# Altium project MB1829.PrjPcb (part 5 of 5)

## Sheet eMMC.SchDoc: eMMC
size A4; Date: Not used; ApprovedBy: Not used; CheckedBy: Not used; Author: Not used; CompanyName: STMicroelectronics; DrawnBy: Not used; Engineer: Not used; Organization: Not used; Address1: Not used; Address2: Not used; Address3: Not used; Address4: Not used; DocumentNumber: Not used; Revision: Not used; SheetNumber: 8; SheetTotal: 16; CurrentTime: Not used; CurrentDate: Not used; Time: Not used; DocumentFullPathAndName: Not used; DocumentName: Not used; ModifiedDate: Not used; ImagePath: Not used; ProjectName: Not used; Application_BuildNumber: Not used
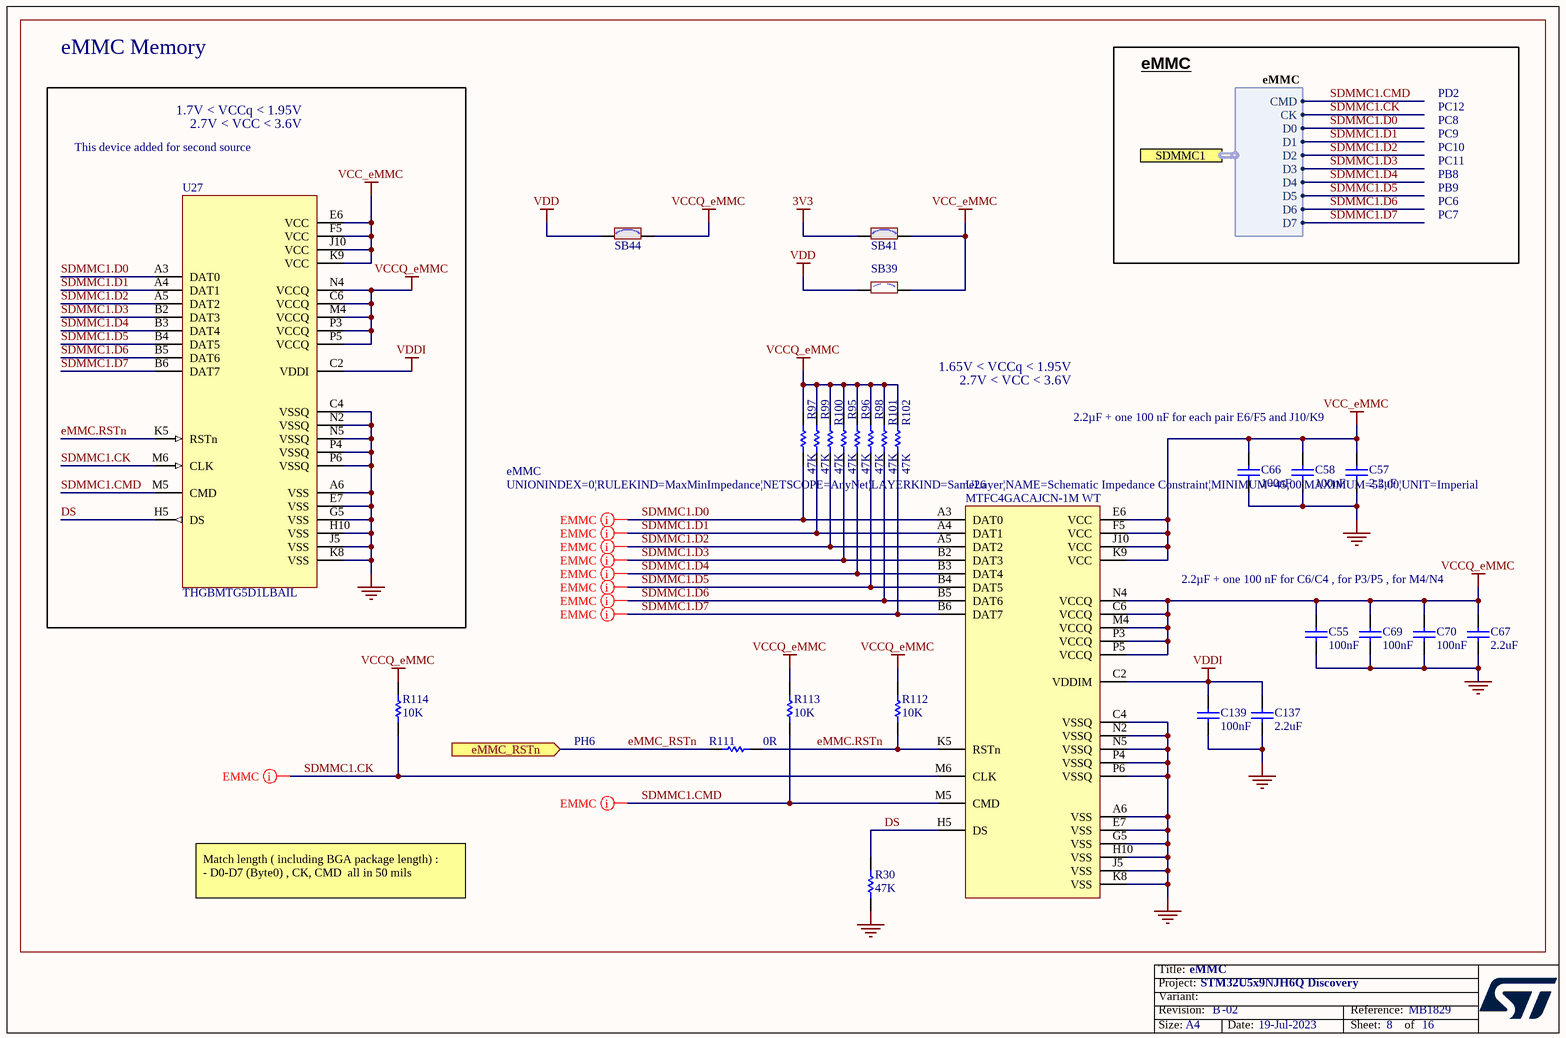
[diagram p12: eMMC.SchDoc]

### Parts
C55  value 100nF  [C0402]  (hidden comment: Capacitor)
C57  value 2.2uF  [C0603]  (hidden comment: Capacitor)
C58  value 100nF  [C0402]  (hidden comment: Capacitor)
C66  value 100nF  [C0402]  (hidden comment: Capacitor)
C67  value 2.2uF  [C0603]  (hidden comment: Capacitor)
C69  value 100nF  [C0402]  (hidden comment: Capacitor)
C70  value 100nF  [C0402]  (hidden comment: Capacitor)
C137  value 2.2uF  [C0603]  (hidden comment: Capacitor)
C139  value 100nF  [C0402]  (hidden comment: Capacitor)
R30  value 47K  [R0402]  (hidden comment: Resistor)
R95  value 47K  [R0402]  (hidden comment: Resistor)
R96  value 47K  [R0402]  (hidden comment: Resistor)
R97  value 47K  [R0402]  (hidden comment: Resistor)
R98  value 47K  [R0402]  (hidden comment: Resistor)
R99  value 47K  [R0402]  (hidden comment: Resistor)
R100  value 47K  [R0402]  (hidden comment: Resistor)
R101  value 47K  [R0402]  (hidden comment: Resistor)
R102  value 47K  [R0402]  (hidden comment: Resistor)
R111  value 0R  [R0402]  (hidden comment: Resistor)
R112  value 10K  [R0402]  (hidden comment: Resistor)
R113  value 10K  [R0402]  (hidden comment: Resistor)
R114  value 10K  [R0402]  (hidden comment: Resistor)
SB39  SB_OFF  [SOLDER-BRIDGE_R0402-0R]  (value not drawn)
SB41  SB_ON  [SOLDER-BRIDGE_R0402-0R]  (value not drawn)
SB44  SB_ON  [SOLDER-BRIDGE_R0402-0R]  (value not drawn)
U26  MTFC4GACAJCN-1M WT  [ICC_P-WFBGA153_13X11P5_P050]
U27  value THGBMTG5D1LBAIL  [ICC_P-WFBGA153_13X11P5_P050]  (hidden comment: eMMC_THGBMTG5D1LBAIL)

### Ports
eMMC_RSTn (in), SDMMC1 (harness eMMC)

### Harnesses
eMMC: D0, CMD, CK, D1, D2, D3, D4, D5, D6, D7

### Nets
3V3: SB41.1
GND: C55.1 C57.1 C58.1 C66.1 C67.1 C69.1 C70.1 C137.1 C139.1 R30.1 U26.A6(VSS) U26.C4(VSSQ) U26.E7(VSS) U26.G5(VSS) U26.H10(VSS) U26.J5(VSS) U26.K8(VSS) U26.N2(VSSQ) U26.N5(VSSQ) U26.P4(VSSQ) U26.P6(VSSQ) U27.A6(VSS) U27.C4(VSSQ) U27.E7(VSS) U27.G5(VSS) U27.H10(VSS) U27.J5(VSS) U27.K8(VSS) U27.N2(VSSQ) U27.N5(VSSQ) U27.P4(VSSQ) U27.P6(VSSQ)
VCC_eMMC: C57.2 C58.2 C66.2 SB39.2 SB41.2 U26.E6(VCC) U26.F5(VCC) U26.J10(VCC) U26.K9(VCC) U27.E6(VCC) U27.F5(VCC) U27.J10(VCC) U27.K9(VCC)
VCCQ_eMMC: C55.2 C67.2 C69.2 C70.2 R95.2 R96.2 R97.2 R98.2 R99.2 R100.2 R101.2 R102.2 R112.2 R113.2 R114.2 SB44.2 U26.C6(VCCQ) U26.M4(VCCQ) U26.N4(VCCQ) U26.P3(VCCQ) U26.P5(VCCQ) U27.C6(VCCQ) U27.M4(VCCQ) U27.N4(VCCQ) U27.P3(VCCQ) U27.P5(VCCQ)
VDD: SB39.1 SB44.1
VDDI: C137.2 C139.2 U26.C2(VDDIM) U27.C2(VDDI)
DS: R30.2 U26.H5(DS) U27.H5(DS)
eMMC.RSTn: R111.2 R112.1 U26.K5(RSTn) U27.K5(RSTn)
eMMC_RSTn: R111.1 ; port eMMC_RSTn
SDMMC1.CK: R114.1 U26.M6(CLK) U27.M6(CLK) ; port SDMMC1.CK
SDMMC1.CMD: R113.1 U26.M5(CMD) U27.M5(CMD) ; port SDMMC1.CMD
SDMMC1.D0: R97.1 U26.A3(DAT0) U27.A3(DAT0) ; port SDMMC1.D0
SDMMC1.D1: R99.1 U26.A4(DAT1) U27.A4(DAT1) ; port SDMMC1.D1
SDMMC1.D2: R100.1 U26.A5(DAT2) U27.A5(DAT2) ; port SDMMC1.D2
SDMMC1.D3: R95.1 U26.B2(DAT3) U27.B2(DAT3) ; port SDMMC1.D3
SDMMC1.D4: R96.1 U26.B3(DAT4) U27.B3(DAT4) ; port SDMMC1.D4
SDMMC1.D5: R98.1 U26.B4(DAT5) U27.B4(DAT5) ; port SDMMC1.D5
SDMMC1.D6: R101.1 U26.B5(DAT6) U27.B5(DAT6) ; port SDMMC1.D6
SDMMC1.D7: R102.1 U26.B6(DAT7) U27.B6(DAT7) ; port SDMMC1.D7

### Layout directives
rule Matched Net Lengths [Tolerance = 20mil]; rule Impedance Constraint [Min = 45.00    Max = 55.00    ]; net class eMMC: SDMMC1.D0
rule Matched Net Lengths [Tolerance = 20mil]; rule Impedance Constraint [Min = 45.00    Max = 55.00    ]: SDMMC1.CK, SDMMC1.D1, SDMMC1.D2, SDMMC1.D3, SDMMC1.D4, SDMMC1.D5, SDMMC1.D6, SDMMC1.D7
rule Matched Net Lengths [Tolerance = 50mil]; rule Impedance Constraint [Min = 45.00    Max = 55.00    ]: SDMMC1.CMD

### Notes on the sheet
- eMMC Memory
- 1.7V < VCCq < 1.95V
- 2.7V < VCC < 3.6V
- eMMC
- PC12
- PD2
- This device added for second source
- PC8
- PC9
- PC10
- PC11
- PB8
- PC6
- PC7
- PB9
- 1.65V < VCCq < 1.95V
- 2.2µF + one 100 nF for each pair E6/F5 and J10/K9
- 2.2µF + one 100 nF for C6/C4 , for P3/P5 , for M4/N4
- PH6
- Match length ( including BGA package length) :
  - D0-D7 (Byte0) , CK, CMD  all in 50 mils
- Title:
- Project:
- Size:
- Revision:
- Variant:
- A4
- -
- Date:
- Reference:
- Sheet:
- of

### Library data of the parts
C55 C58 C66 C69 C70 C139 = MCD-00006: Capacitor, MLCC, 100nF, 16V, X7R, +/-10%, 0402, T=0.5mm; Manufacturer_Part_Number: CC0402KRX7R7BB104; Manufacturer: YAGEO; Part_Preference: Recommended; Order_Code_RS: 616-9701; Component_Country_Of_Origin: China; Internal_Part_Number: MCD-00006; Status: Released; Part_Type: Capacitor; Package: 0402; ComponentLink1URL: http://tunmcdsvn.tun.st.com/Component_Documentation_Library/Trunk/Capacitor/YAGEO_X7R_Series; Order_Code_Digikey: 311-1338-1-ND; Order_Code_Farnell: 9402047
C57 C67 C137 = MCD-00012: Capacitor, MLCC, 2.2uF, 10V, X5R, +/- 10%, 0603, T=0.8mm; Manufacturer_Part_Number: CC0603KRX5R6BB225; Manufacturer: YAGEO; BMS_Part_Number: 9142010; Part_Preference: Recommended; Component_Country_Of_Origin: China; Internal_Part_Number: MCD-00012; Status: Released; Part_Type: Capacitor; Package: 0603; ComponentLink1URL: http://tunmcdsvn.tun.st.com/Component_Documentation_Library/Trunk/Capacitor/YAGEO_X5R_Series; Order_Code_Digikey: 311-1451-1-ND; Order_Code_Farnell: 2370679; Order_Code_RS: N/A
R30 R95-R102 = MCD-00063: Resistor, 47K, 0402, +/-1%, 1/16W; Manufacturer_Part_Number: RC0402FR-0747KL; Manufacturer: YAGEO; Part_Preference: Recommended; Component_Country_Of_Origin: China; Internal_Part_Number: MCD-00063; Status: Released; Part_Type: Resistor; Package: 0402; ComponentLink1URL: http://tunmcdsvn.tun.st.com/Component_Documentation_Library/Trunk/Resistor/YAGEO_RC_L_Series; Order_Code_Digikey: 311-47.0KLRCT-ND; Order_Code_Farnell: 9239430; Order_Code_RS: N/A
R111 = MCD-00052: Resistor, 0R, 0402, +/-5%, 1/16W; Manufacturer_Part_Number: RC0402JR-070RL; Manufacturer: YAGEO; Part_Preference: Recommended; Order_Code_RS: 618-5804; Component_Country_Of_Origin: China; Internal_Part_Number: MCD-00052; Status: Released; Part_Type: Resistor; Package: 0402; ComponentLink1URL: http://tunmcdsvn.tun.st.com/Component_Documentation_Library/Trunk/Resistor/YAGEO_RC_L_Series; Order_Code_Digikey: 311-0.0JRCT-ND; Order_Code_Farnell: 9232516RL
R112-R114 = MCD-00053: Resistor, 10K, 0402, +/-1%, 1/16W; Manufacturer_Part_Number: RC0402FR-0710KL; Manufacturer: YAGEO; BMS_Part_Number: 9131590; Part_Preference: Recommended; Component_Country_Of_Origin: China; Internal_Part_Number: MCD-00053; Status: Released; Part_Type: Resistor; Package: 0402; ComponentLink1URL: http://tunmcdsvn.tun.st.com/Component_Documentation_Library/Trunk/Resistor/YAGEO_RC_L_Series; Order_Code_Digikey: 311-10.0KLRCT-ND; Order_Code_Farnell: 9239359; Order_Code_RS: N/A
SB39 = MCD-02162: Solder Bridge 0402 OFF; Part_Type: Misc; Manufacturer_Part_Number: RC0402JR-070RL; Manufacturer: YAGEO; Part_Preference: Recommended; Order_Code_RS: 618-5804; Component_Country_Of_Origin: China; Internal_Part_Number: MCD-02162; Status: Checked; Package: SB0402; ComponentLink1URL: http://tunmcdsvn.tun.st.com/Component_Datasheet_Library/Trunk/Resistors/Yageo_Resistor_RC0402-series; Order_Code_Digikey: 311-0.0JRTR-ND; Order_Code_Farnell: 2363467
SB41 SB44 = MCD-01618: Solder Bridge 0402 ON; Part_Type: Misc; Manufacturer_Part_Number: RC0402JR-070RL; Manufacturer: YAGEO; Part_Preference: Recommended; Order_Code_RS: 618-5804; Component_Country_Of_Origin: China; Internal_Part_Number: MCD-01618; Status: Released; Package: SB0402; ComponentLink1URL: http://tunmcdsvn.tun.st.com/Component_Datasheet_Library/Trunk/Resistors/Yageo_Resistor_RC0402-series; Order_Code_Digikey: 311-0.0JRTR-ND; Order_Code_Farnell: 2363467
U26 = MCD-01137: 4G MultiMediaCard (MMC) controller and NAND Flash; Part_Type: IC; Manufacturer: MICRON; BMS_Part_Number: 9171977; Part_Preference: Recommended; Component_Country_Of_Origin: Singapore; Internal_Part_Number: MCD-01137; Value: MTFC4GACAJCN-1M WT; Status: Released; Manufacturer_Part_Number: MTFC4GACAJCN-1M WT; Package: FBGA153; ComponentLink1URL: http://tunmcdsvn.tun.st.com/Component_Datasheet_Library/Trunk/IC/MICRON_eMMC_MTFC4GACAJCN-1M WT
U27 = MCD-02799: Memory, eMMC, 4GB, 15nm ,WFBGA , 153 pins; Part_Type: IC; Part_Preference: Recommended; Manufacturer: KIOXIA; Component_Country_Of_Origin: Unknown; ShowFields: YES; ID: 4911; Internal_Part_Number: MCD-02799; Status: Checked; Manufacturer_Part_Number: THGBMTG5D1LBAIL; Package: WFBGA153; ComponentLink1URL: http://tunmcdsvn.tun.st.com/Component_Documentation_Library/Trunk/IC/KIOXIA_THGBMTG5D1LBAIL; Order_Code_Digikey: N/A; Order_Code_Farnell: N/A; Order_Code_RS: N/A

## Sheet HEXADECASPI_PSRAM.SchDoc: HEXADECASPI PSRAM
size A4; Date: Not used; ApprovedBy: Not used; CheckedBy: Not used; Author: Not used; CompanyName: STMicroelectronics; DrawnBy: Not used; Engineer: Not used; Organization: Not used; Address1: Not used; Address2: Not used; Address3: Not used; Address4: Not used; DocumentNumber: Not used; Revision: Not used; SheetNumber: 7; SheetTotal: 16; CurrentTime: Not used; CurrentDate: Not used; Time: Not used; DocumentFullPathAndName: Not used; DocumentName: Not used; ModifiedDate: Not used; ImagePath: Not used; ProjectName: Not used; Application_BuildNumber: Not used
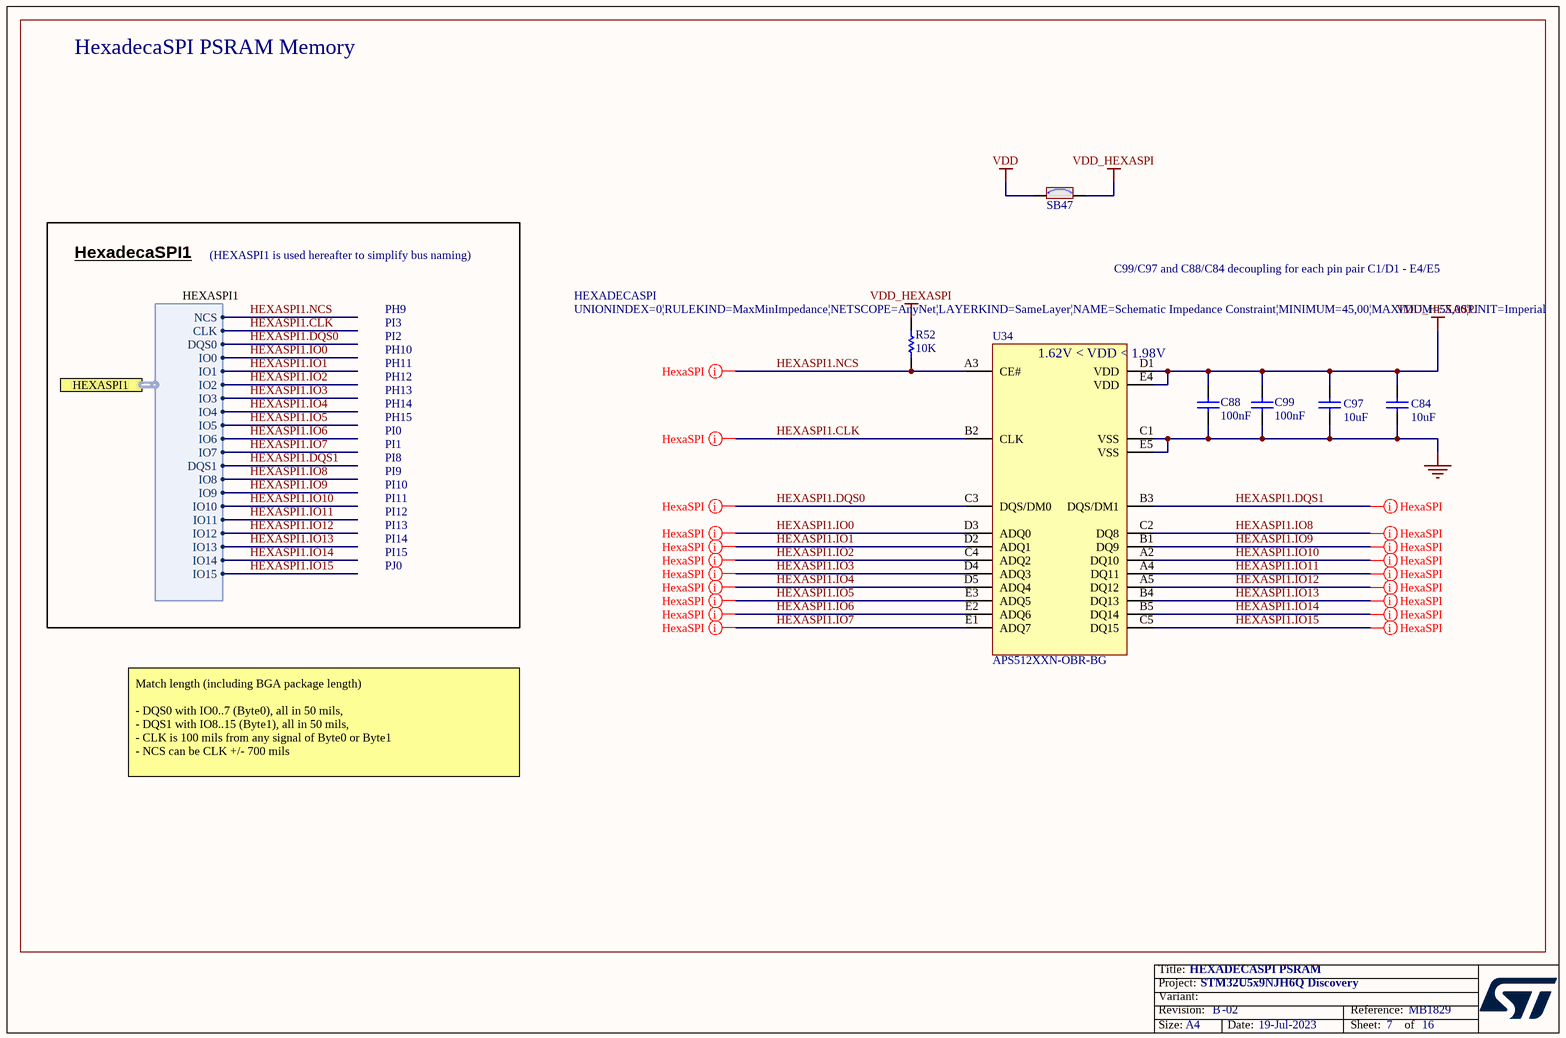
[diagram p13: HEXADECASPI_PSRAM.SchDoc]

### Parts
C84  value 10uF  [C0603_H0P8]  (hidden comment: Capacitor)
C88  value 100nF  [C0402]  (hidden comment: Capacitor)
C97  value 10uF  [C0603_H0P8]  (hidden comment: Capacitor)
C99  value 100nF  [C0402]  (hidden comment: Capacitor)
R52  value 10K  [R0402]  (hidden comment: Resistor)
SB47  SB_ON  [SOLDER-BRIDGE_R0402-0R]  (value not drawn)
U34  value APS512XXN-OBR-BG  [ICC_BGA24_5X5-BALL-ARRAY_6X8_P1]  (hidden comment: APS256XXN-OBR-BG)

### Ports
HEXASPI1 (harness HEXASPI1)

### Harnesses
HEXASPI1: IO1, IO0, DQS0, NCS, IO2, IO3, IO5, IO4, IO6, IO7, CLK, DQS1, IO8, IO9, IO10, IO11, IO12, IO13, IO14, IO15

### Nets
GND: C84.1 C88.1 C97.1 C99.1 U34.C1(VSS) U34.E5(VSS)
VDD: SB47.1
VDD_HEXASPI: C84.2 C88.2 C97.2 C99.2 R52.2 SB47.2 U34.D1(VDD) U34.E4(VDD)
HEXASPI1.CLK: U34.B2(CLK) ; port HEXASPI1.CLK
HEXASPI1.DQS0: U34.C3(DQS/DM0) ; port HEXASPI1.DQS0
HEXASPI1.DQS1: U34.B3(DQS/DM1) ; port HEXASPI1.DQS1
HEXASPI1.IO0: U34.D3(ADQ0) ; port HEXASPI1.IO0
HEXASPI1.IO1: U34.D2(ADQ1) ; port HEXASPI1.IO1
HEXASPI1.IO2: U34.C4(ADQ2) ; port HEXASPI1.IO2
HEXASPI1.IO3: U34.D4(ADQ3) ; port HEXASPI1.IO3
HEXASPI1.IO4: U34.D5(ADQ4) ; port HEXASPI1.IO4
HEXASPI1.IO5: U34.E3(ADQ5) ; port HEXASPI1.IO5
HEXASPI1.IO6: U34.E2(ADQ6) ; port HEXASPI1.IO6
HEXASPI1.IO7: U34.E1(ADQ7) ; port HEXASPI1.IO7
HEXASPI1.IO8: U34.C2(DQ8) ; port HEXASPI1.IO8
HEXASPI1.IO9: U34.B1(DQ9) ; port HEXASPI1.IO9
HEXASPI1.IO10: U34.A2(DQ10) ; port HEXASPI1.IO10
HEXASPI1.IO11: U34.A4(DQ11) ; port HEXASPI1.IO11
HEXASPI1.IO12: U34.A5(DQ12) ; port HEXASPI1.IO12
HEXASPI1.IO13: U34.B4(DQ13) ; port HEXASPI1.IO13
HEXASPI1.IO14: U34.B5(DQ14) ; port HEXASPI1.IO14
HEXASPI1.IO15: U34.C5(DQ15) ; port HEXASPI1.IO15
HEXASPI1.NCS: R52.1 U34.A3(CE#) ; port HEXASPI1.NCS

### Layout directives
rule Matched Net Lengths [Tolerance = 1000mil]; net class HEXASPI; rule Impedance Constraint [Min = 50.00    Max = 60.00    ]; rule Routing Layers [TopLayer - Enabled BottomLayer - Enabled ]: HEXASPI1.NCS
rule Matched Net Lengths [Tolerance = 20mil]; net class HEXASPI; rule Impedance Constraint [Min = 45.00    Max = 55.00    ]; rule Routing Layers [TopLayer - Enabled BottomLayer - Enabled ]: HEXASPI1.DQS1, HEXASPI1.IO0, HEXASPI1.IO1, HEXASPI1.IO2, HEXASPI1.IO3, HEXASPI1.IO4, HEXASPI1.IO5, HEXASPI1.IO6, HEXASPI1.IO7, HEXASPI1.IO8, HEXASPI1.IO9, HEXASPI1.IO10, HEXASPI1.IO11, HEXASPI1.IO12, HEXASPI1.IO13, HEXASPI1.IO14, HEXASPI1.IO15
rule Matched Net Lengths [Tolerance = 20mil]; net class HEXADECASPI; rule Impedance Constraint [Min = 45.00    Max = 55.00    ]; rule Routing Layers [TopLayer - Enabled BottomLayer - Enabled ]: HEXASPI1.CLK
rule Matched Net Lengths [Tolerance = 20mil]; net class HEXASPI; rule Impedance Constraint [Min = 50.00    Max = 60.00    ]; rule Routing Layers [TopLayer - Enabled BottomLayer - Enabled ]: HEXASPI1.DQS0

### Notes on the sheet
- HexadecaSPI PSRAM Memory
- HexadecaSPI1
- (HEXASPI1 is used hereafter to simplify bus naming)
- PH9
- C99/C97 and C88/C84 decoupling for each pin pair C1/D1 - E4/E5
- PH10
- PH11
- PH12
- PI2
- PI3
- 1.62V < VDD < 1.98V
- PH13
- PH14
- PH15
- PI0
- PI1
- PI8
- PI9
- PI10
- PI11
- PI12
- PI13
- PI14
- PI15
- PJ0
- Match length (including BGA package length)
  - DQS0 with IO0..7 (Byte0), all in 50 mils,
  - DQS1 with IO8..15 (Byte1), all in 50 mils,
  - CLK is 100 mils from any signal of Byte0 or Byte1
  - NCS can be CLK +/- 700 mils
- Title:
- Project:
- Size:
- Revision:
- Variant:
- A4
- -
- Date:
- Reference:
- Sheet:
- of

### Library data of the parts
C84 C97 = MCD-02605: Capacitor, MLCC, 10uF, 10V, X5R, +/-10%, 0603, T=0.8mm; Manufacturer_Part_Number: CC0603KRX5R6BB106; Manufacturer: YAGEO; Part_Preference: Recommended; Order_Code_RS: 2006536; ShowFields: YES; ID: 4711; Internal_Part_Number: MCD-02605; Status: Checked; Part_Type: Capacitor; Package: 0603; ComponentLink1URL: http://tunmcdsvn.tun.st.com/Component_Documentation_Library/Trunk/Capacitor/YAGEO_X5R_Series; Order_Code_Digikey: 311-1782-2-ND; Order_Code_Farnell: 3759761
C88 C99 = MCD-00006: as C55 on sheet eMMC; Internal_Part_Number: MCD-00006; Status: Released; Part_Type: Capacitor; Package: 0402; ComponentLink1URL: http://tunmcdsvn.tun.st.com/Component_Documentation_Library/Trunk/Capacitor/YAGEO_X7R_Series; Order_Code_Digikey: 311-1338-1-ND; Order_Code_Farnell: 9402047
R52 = MCD-00053: as R112-R114 on sheet eMMC; Internal_Part_Number: MCD-00053; Status: Released; Part_Type: Resistor; ComponentLink1URL: http://tunmcdsvn.tun.st.com/Component_Documentation_Library/Trunk/Resistor/YAGEO_RC_L_Series; Package: 0402; Order_Code_Digikey: 311-10.0KLRCT-ND; Order_Code_Farnell: 9239359; Order_Code_RS: N/A
SB47 = MCD-01618: as SB41 on sheet eMMC; Internal_Part_Number: MCD-01618; Status: Released; Package: SB0402; ComponentLink1URL: http://tunmcdsvn.tun.st.com/Component_Datasheet_Library/Trunk/Resistors/Yageo_Resistor_RC0402-series; Order_Code_Digikey: 311-0.0JRTR-ND; Order_Code_Farnell: 2363467
U34 = MCD-02904: Memory,Hexa-SPI-PSRAM,512Mb,x8x16,200MHz,1.8V,DDR,BGA24, PASR LVCMOS; Part_Type: IC; Manufacturer: AP MEMORY TECHNOLOGY CORP.; Part_Preference: Recommended; ShowFields: YES; ID: 5020; Internal_Part_Number: MCD-02904; Status: New; Manufacturer_Part_Number: APS512XXN-OBR-BG; Package: BGA24; ComponentLink1URL: http://tunmcdsvn.tun.st.com/Component_Documentation_Library/Trunk/IC/AP_MEMORY_TECHNOLOGY_CORP_APS512XXN-OBR-BG; Order_Code_Digikey: N/A; Order_Code_Farnell: N/A; Order_Code_RS: N/A

## Sheet DSI_LCD.SchDoc: DSI LCD
size A4; Date: Not used; ApprovedBy: Not used; CheckedBy: Not used; Author: Not used; CompanyName: STMicroelectronics; DrawnBy: Not used; Engineer: Not used; Organization: Not used; Address1: Not used; Address2: Not used; Address3: Not used; Address4: Not used; DocumentNumber: Not used; Revision: Not used; SheetNumber: 10; SheetTotal: 16; CurrentTime: Not used; CurrentDate: Not used; Time: Not used; DocumentFullPathAndName: Not used; DocumentName: Not used; ModifiedDate: Not used; ImagePath: Not used; ProjectName: Not used; Application_BuildNumber: Not used
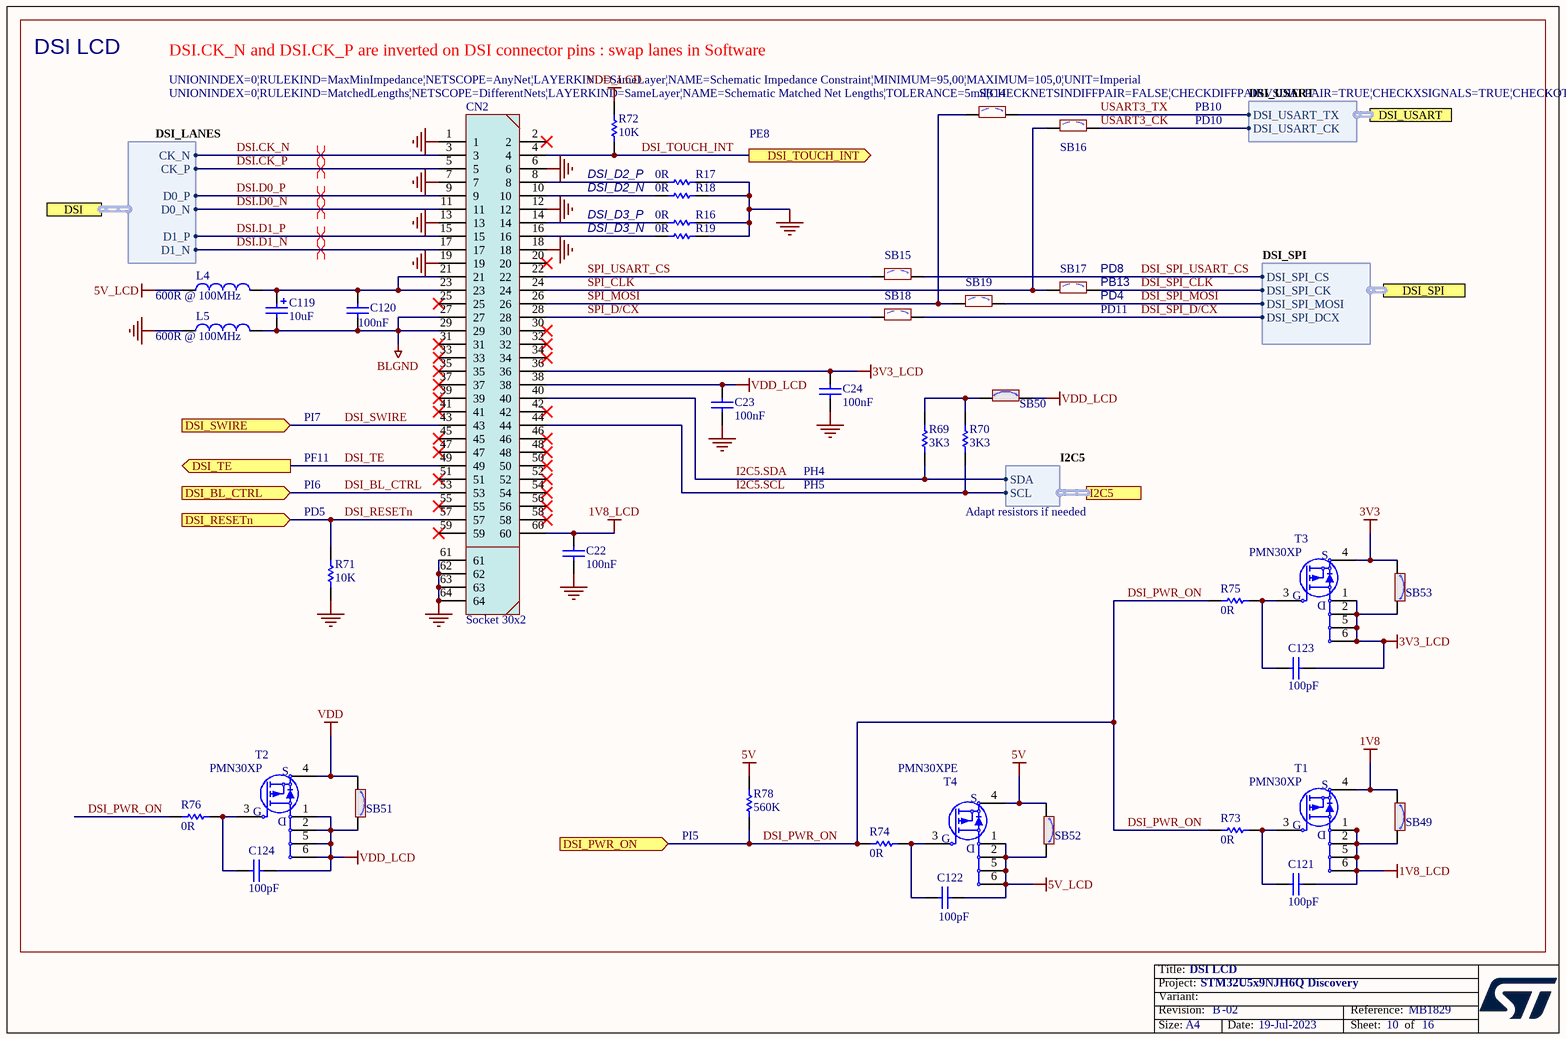
[diagram p14: DSI_LCD.SchDoc]

### Parts
C22  value 100nF  [C0402]  (hidden comment: Capacitor)
C23  value 100nF  [C0402]  (hidden comment: Capacitor)
C24  value 100nF  [C0402]  (hidden comment: Capacitor)
C119  value 10uF  [CPOL_TAJ-A_1206_H180]  (hidden comment: Cap_POL_TANA)
C120  value 100nF  [C0402]  (hidden comment: Capacitor)
C121  value 100pF  [C0603]  (hidden comment: Capacitor)
C122  value 100pF  [C0603]  (hidden comment: Capacitor)
C123  value 100pF  [C0603]  (hidden comment: Capacitor)
C124  value 100pF  [C0603]  (hidden comment: Capacitor)
CN2  value Socket 30x2  [CON_SAMTEC_QSH-030-01-F-D-A_no-LCD-MB1835]  (hidden comment: Socket QSH-030-01-F-D-A_DSI_LCD)
L4  value 600R @ 100MHz  [L0603]  (hidden comment: BEAD)
L5  value 600R @ 100MHz  [L0603]  (hidden comment: BEAD)
R16  value 0R  [R0402]  (hidden comment: Resistor)
R17  value 0R  [R0402]  (hidden comment: Resistor)
R18  value 0R  [R0402]  (hidden comment: Resistor)
R19  value 0R  [R0402]  (hidden comment: Resistor)
R69  value 3K3  [R0402]  (hidden comment: Resistor)
R70  value 3K3  [R0402]  (hidden comment: Resistor)
R71  value 10K  [R0402]  (hidden comment: Resistor)
R72  value 10K  [R0402]  (hidden comment: Resistor)
R73  value 0R  [R0603]  (hidden comment: Resistor)
R74  value 0R  [R0603]  (hidden comment: Resistor)
R75  value 0R  [R0603]  (hidden comment: Resistor)
R76  value 0R  [R0603]  (hidden comment: Resistor)
R78  value 560K  [R0402]  (hidden comment: Resistor)
SB14  SB_OFF  [SOLDER-BRIDGE_R0402-0R]  (value not drawn)
SB15  SB_OFF  [SOLDER-BRIDGE_R0402-0R]  (value not drawn)
SB16  SB_OFF  [SOLDER-BRIDGE_R0402-0R]  (value not drawn)
SB17  SB_OFF  [SOLDER-BRIDGE_R0402-0R]  (value not drawn)
SB18  SB_OFF  [SOLDER-BRIDGE_R0402-0R]  (value not drawn)
SB19  SB_OFF  [SOLDER-BRIDGE_R0402-0R]  (value not drawn)
SB49  SB_ON  [SOLDER-BRIDGE_R0402-0R]  (value not drawn)
SB50  SB_ON  [SOLDER-BRIDGE_R0402-0R]  (value not drawn)
SB51  SB_ON  [SOLDER-BRIDGE_R0402-0R]  (value not drawn)
SB52  SB_ON  [SOLDER-BRIDGE_R0402-0R]  (value not drawn)
SB53  SB_ON  [SOLDER-BRIDGE_R0402-0R]  (value not drawn)
T1  PMN30XP  [MOS_SOT23-6L]
T2  PMN30XP  [MOS_SOT23-6L]
T3  PMN30XP  [MOS_SOT23-6L]
T4  value PMN30XPE  [MOS_SOT23-6L]  (hidden comment: PMN30XP)

### Ports
DSI (harness DSI_LANES), DSI_BL_CTRL (in), DSI_PWR_ON (in), DSI_RESETn (in), DSI_SPI (harness DSI_SPI), DSI_SWIRE (in), DSI_TE (out), DSI_TOUCH_INT (out), DSI_USART (harness DSI_USART), I2C5 (harness I2C5)

### Harnesses
I2C5: SDA, SCL
DSI_USART: DSI_USART_CK, DSI_USART_TX
DSI_SPI: DSI_SPI_CS, DSI_SPI_MOSI, DSI_SPI_CK, DSI_SPI_DCX
DSI_LANES: CK_P, CK_N, D0_P, D0_N, D1_N, D1_P

### Nets
1V8: SB49.1 T1.4(S)
1V8_LCD: C22.2 C121.2 CN2.60 SB49.2 T1.1(S) T1.2(S) T1.5(D) T1.6(D)
3V3: SB53.1 T3.4(S)
3V3_LCD: C24.2 C123.2 CN2.36 SB53.2 T3.1(S) T3.2(S) T3.5(D) T3.6(D)
5V: R78.2 SB52.1 T4.4(S)
5V_LCD: C122.2 L4.1 SB52.2 T4.1(S) T4.2(S) T4.5(D) T4.6(D)
BLGND: C119.2 C120.1 CN2.27 CN2.29 L5.2
GND: C22.1 C23.1 C24.1 CN2.1 CN2.6 CN2.7 CN2.12 CN2.13 CN2.18 CN2.19 CN2.61 CN2.62 CN2.63 CN2.64 L5.1 R16.2 R17.2 R18.2 R19.2 R71.1
VDD: SB51.1 T2.4(S)
VDD_LCD: C23.2 C124.2 CN2.38 R72.2 SB50.2 SB51.2 T2.1(S) T2.2(S) T2.5(D) T2.6(D)
DSI.CK_N: CN2.3 ; port DSI.CK_N
DSI.CK_P: CN2.5 ; port DSI.CK_P
DSI.D0_N: CN2.11 ; port DSI.D0_N
DSI.D0_P: CN2.9 ; port DSI.D0_P
DSI.D1_N: CN2.17 ; port DSI.D1_N
DSI.D1_P: CN2.15 ; port DSI.D1_P
DSI_BL_CTRL: CN2.53 ; port DSI_BL_CTRL
DSI_PWR_ON: R73.1 R74.1 R75.1 R76.1 R78.1 ; port DSI_PWR_ON
DSI_RESETn: CN2.57 R71.2 ; port DSI_RESETn
DSI_SPI_CLK: SB17.2 ; port DSI_SPI.DSI_SPI_CK
DSI_SPI_D/CX: SB18.2 ; port DSI_SPI.DSI_SPI_DCX
DSI_SPI_MOSI: SB19.2 ; port DSI_SPI.DSI_SPI_MOSI
DSI_SPI_USART_CS: SB15.2 ; port DSI_SPI.DSI_SPI_CS
DSI_SWIRE: CN2.43 ; port DSI_SWIRE
DSI_TE: CN2.49 ; port DSI_TE
DSI_TOUCH_INT: CN2.4 R72.1 ; port DSI_TOUCH_INT
I2C5.SCL: CN2.44 R70.2 ; port I2C5.SCL
I2C5.SDA: CN2.40 R69.2 ; port I2C5.SDA
SPI_CLK: CN2.24 SB16.1 SB17.1
SPI_D/CX: CN2.28 SB18.1
SPI_MOSI: CN2.26 SB14.1 SB19.1
SPI_USART_CS: CN2.22 SB15.1
USART3_CK: SB16.2 ; port DSI_USART.DSI_USART_CK  [project net PD10]
USART3_TX: SB14.2 ; port DSI_USART.DSI_USART_TX  [project net PB10]
NetC119_1: C119.1 C120.2 CN2.21 CN2.23 L4.2
NetC121_1: C121.1 R73.2 T1.3(G)
NetC122_1: C122.1 R74.2 T4.3(G)
NetC123_1: C123.1 R75.2 T3.3(G)
NetC124_1: C124.1 R76.2 T2.3(G)
NetCN2_8: CN2.8 R17.1
NetCN2_10: CN2.10 R18.1
NetCN2_14: CN2.14 R16.1
NetCN2_16: CN2.16 R19.1
NetR69_1: R69.1 R70.1 SB50.1

Not connected (* = marked no-connect by the designer): CN2 2* 20* 25* 30* 31* 32* 33* 34* 35* 37* 39* 41* 42* 45* 46* 47* 48* 50* 51* 52* 54* 55* 56* 58* 59*

### Layout directives
differential pair; rule Impedance Constraint [Min = 95.00    Max = 105.0    ]; rule Matched Net Lengths [Tolerance = 5mil]: DSI.CK_N
differential pair; rule Impedance Constraint [Min = 95.00    Max = 105.0    ]; rule Matched Net Lengths [Tolerance = 0mil]: DSI.CK_P, DSI.D0_N, DSI.D0_P, DSI.D1_N, DSI.D1_P

### Notes on the sheet
- DSI LCD
- DSI.CK_N and DSI.CK_P are inverted on DSI connector pins : swap lanes in Software
- PB10
- DSI_D2_P
- PE8
- PD10
- DSI_D2_N
- DSI_D3_P
- DSI_D3_N
- (near SB17) PD11
- (near SB17) PD4
- (near SB17) PD8
- (near SB17) PB13
- PI7
- PI6
- PF11
- (near R71) PD5
- PH5
- PH4
- Adapt resistors if needed
- (near R78) PI5
- Title:
- Project:
- Size:
- Revision:
- Variant:
- A4
- -
- Date:
- Reference:
- Sheet:
- of

### Library data of the parts
C22-C24 C120 = MCD-00006: as C55 on sheet eMMC; Internal_Part_Number: MCD-00006; Status: Released; Part_Type: Capacitor; Package: 0402; ComponentLink1URL: http://tunmcdsvn.tun.st.com/Component_Documentation_Library/Trunk/Capacitor/YAGEO_X7R_Series; Order_Code_Digikey: 311-1338-1-ND; Order_Code_Farnell: 9402047
C119 = MCD-00199: Capacitor, Tantalum, 10uF, 16V, 3R, +/-10%, Type_A (3216 metric), T=1.6mm; Manufacturer_Part_Number: TAJA106K016R; Manufacturer: AVX; BMS_Part_Number: 9141044; Part_Preference: Recommended; Order_Code_RS: 699-2848; Component_Country_Of_Origin: El Salvador; Revision: July-2002: Re-released for DXP Platform.; Internal_Part_Number: MCD-00199; Status: Checked; Part_Type: Capacitor; Package: 3216 (metric); ComponentLink1URL: http://tunmcdsvn.tun.st.com/Component_Documentation_Library/Trunk/Capacitor/AVX_TAJ_Series; Order_Code_Digikey: 478-1655-1-ND; Order_Code_Farnell: 1432339
C121-C124 = MCD-01101: Capacitor, MLCC, 100pF, 50V, X7R, +/-5%, 0603, T=0.33mm; Manufacturer_Part_Number: 06035C101JAT4A; Manufacturer: AVX; Part_Preference: Recommended; Component_Country_Of_Origin: China; Internal_Part_Number: MCD-01101; Status: Checked; Part_Type: Capacitor; Package: 0603; ComponentLink1URL: http://tunmcdsvn.tun.st.com/Component_Documentation_Library/Trunk/Capacitor/AVX_X7R_Series; Order_Code_Digikey: 06035C101JAT4A-ND; Order_Code_Farnell: 2332634; Order_Code_RS: N/A
CN2 = MCD-02128: Socket, 30x2, 0.5mm, VR, SMD, T=3.05mm; Part_Type: Connector; Manufacturer: SAMTEC; Part_Preference: Recommended; Order_Code_RS: 180-2587; Component_Country_Of_Origin: China, Costa Rica, Malaysia, United States, Vietnam; Internal_Part_Number: MCD-02128; Status: Checked; Manufacturer_Part_Number: QSH-030-01-F-D-A; ComponentLink1URL: http://tunmcdsvn.tun.st.com/Component_Documentation_Library/Trunk/Connector/SAMTEC_QSH_Series/; Order_Code_Digikey: SAM13214TR-ND; Order_Code_Farnell: N/A
L4 L5 = MCD-00047: Ferrite bead, 600R @1 00MHz, +/-25%, 350mA, 0R5, 0603, T=0.8mm; Part_Type: Inductor; Manufacturer_Part_Number: FCM1608KF-601T03; Manufacturer: TAI-TECH; Part_Preference: Recommended; Component_Country_Of_Origin: Unknown; Internal_Part_Number: MCD-00047; Status: Released; ComponentLink1URL: http://tunmcdsvn.tun.st.com/Component_Documentation_Library/Trunk/Inductor/TAI-TECH_FCM-1608_Series; Package: 0603; Order_Code_Digikey: N/A; Order_Code_Farnell: N/A; Order_Code_RS: N/A
R16-R19 = MCD-00052: as R111 on sheet eMMC; Internal_Part_Number: MCD-00052; Status: Released; Part_Type: Resistor; Package: 0402; ComponentLink1URL: http://tunmcdsvn.tun.st.com/Component_Documentation_Library/Trunk/Resistor/YAGEO_RC_L_Series; Order_Code_Digikey: 311-0.0JRCT-ND; Order_Code_Farnell: 9232516RL
R69 R70 = MCD-00184: Resistor, 3K3, 0402, +/-1%, 1/16W; BMS_Part_Number: 9131946; Manufacturer: YAGEO; Manufacturer_Part_Number: RC0402FR-073K3L; Part_Preference: Recommended; Component_Country_Of_Origin: China; Internal_Part_Number: MCD-00184; Status: Released; Part_Type: Resistor; Package: 0402; ComponentLink1URL: http://tunmcdsvn.tun.st.com/Component_Documentation_Library/Trunk/Resistor/YAGEO_RC_L_Series; Order_Code_Digikey: 311-3.30KLRCT-ND; Order_Code_Farnell: 9239294; Order_Code_RS: N/A
R71 R72 = MCD-00053: as R112-R114 on sheet eMMC; Internal_Part_Number: MCD-00053; Status: Released; Part_Type: Resistor; ComponentLink1URL: http://tunmcdsvn.tun.st.com/Component_Documentation_Library/Trunk/Resistor/YAGEO_RC_L_Series; Package: 0402; Order_Code_Digikey: 311-10.0KLRCT-ND; Order_Code_Farnell: 9239359; Order_Code_RS: N/A
R73-R76 = MCD-00056: Resistor, 0R, 0603, +/-5%, 1/10W; Manufacturer_Part_Number: RC0603JR-070RL; Manufacturer: YAGEO; Part_Preference: Recommended; Component_Country_Of_Origin: China; Internal_Part_Number: MCD-00056; Status: Released; Part_Type: Resistor; Package: 0603; ComponentLink1URL: http://tunmcdsvn.tun.st.com/Component_Documentation_Library/Trunk/Resistor/YAGEO_RC_L_Series; Order_Code_Digikey: 311-0.0GRCT-ND; Order_Code_Farnell: 9233130RL; Order_Code_RS: N/A
R78 = MCD-00495: Resistor, 560K, 0402, +/-1%, 1/16W; Manufacturer_Part_Number: RC0402FR-07560KL; Manufacturer: YAGEO; Part_Preference: Recommended; Component_Country_Of_Origin: China; ShowFields: YES; ID: 2779; Internal_Part_Number: MCD-00495; Status: Released; Part_Type: Resistor; Package: 0402; ComponentLink1URL: http://tunmcdsvn.tun.st.com/Component_Documentation_Library/Trunk/Resistor/YAGEO_RC_L_Series; Order_Code_Digikey: 311-560KLRCT-ND; Order_Code_Farnell: 1458810; Order_Code_RS: N/A
SB14-SB19 = MCD-02162: as SB39 on sheet eMMC; Internal_Part_Number: MCD-02162; Status: Checked; Package: SB0402; ComponentLink1URL: http://tunmcdsvn.tun.st.com/Component_Datasheet_Library/Trunk/Resistors/Yageo_Resistor_RC0402-series; Order_Code_Digikey: 311-0.0JRTR-ND; Order_Code_Farnell: 2363467
SB49-SB53 = MCD-01618: as SB41 on sheet eMMC; Internal_Part_Number: MCD-01618; Status: Released; Package: SB0402; ComponentLink1URL: http://tunmcdsvn.tun.st.com/Component_Datasheet_Library/Trunk/Resistors/Yageo_Resistor_RC0402-series; Order_Code_Digikey: 311-0.0JRTR-ND; Order_Code_Farnell: 2363467
T1-T3 = MCD-01926: 20 V, P-channel Trench MOSFET; Part_Type: IC; Manufacturer_Part_Number: PMN30XPX; Manufacturer: NEXPERIA; Part_Preference: Recommended; Order_Code_RS: 153-0671; Component_Country_Of_Origin: China; Internal_Part_Number: MCD-01926; Value: PMN30XP; Status: Checked; Package: TSOP6; ComponentLink1URL: http://tunmcdsvn.tun.st.com/Component_Datasheet_Library/Trunk/IC/NEXPERIA_P_Channel_MOSFET_PMN30XP; Order_Code_Digikey: 1727-2699-1-ND; Order_Code_Farnell: 2545273
T4 = MCD-03170: Transistor, MOSFET, P-CH, -20V, 7A, SOT457; Part_Preference: Recommended; Manufacturer: NEXPERIA; Partial_Alternate_Internal_Part_Number: MCD-01926; ShowFields: YES; ID: 5286; Component_Country_Of_Origin: China°; Internal_Part_Number: MCD-03170; Status: Checked; Part_Type: Transistor; Manufacturer_Part_Number: PMN30XPE; Package: TSOP6; ComponentLink1URL: http://tunmcdsvn.tun.st.com/Component_Documentation_Library/Trunk/IC/NEXPERIA_PMN30XPE; Order_Code_Digikey: PMN30XPEX-ND; Order_Code_Farnell: 3132376RL; Order_Code_RS: N/A

## Sheet MEMS.SchDoc: MEMS
size A4; Date: Not used; ApprovedBy: Not used; CheckedBy: Not used; Author: Not used; CompanyName: STMicroelectronics; DrawnBy: Not used; Engineer: Not used; Organization: Not used; Address1: Not used; Address2: Not used; Address3: Not used; Address4: Not used; DocumentNumber: Not used; Revision: Not used; SheetNumber: 12; SheetTotal: 16; CurrentTime: Not used; CurrentDate: Not used; Time: Not used; DocumentFullPathAndName: Not used; DocumentName: Not used; ModifiedDate: Not used; ImagePath: Not used; ProjectName: Not used; Application_BuildNumber: Not used
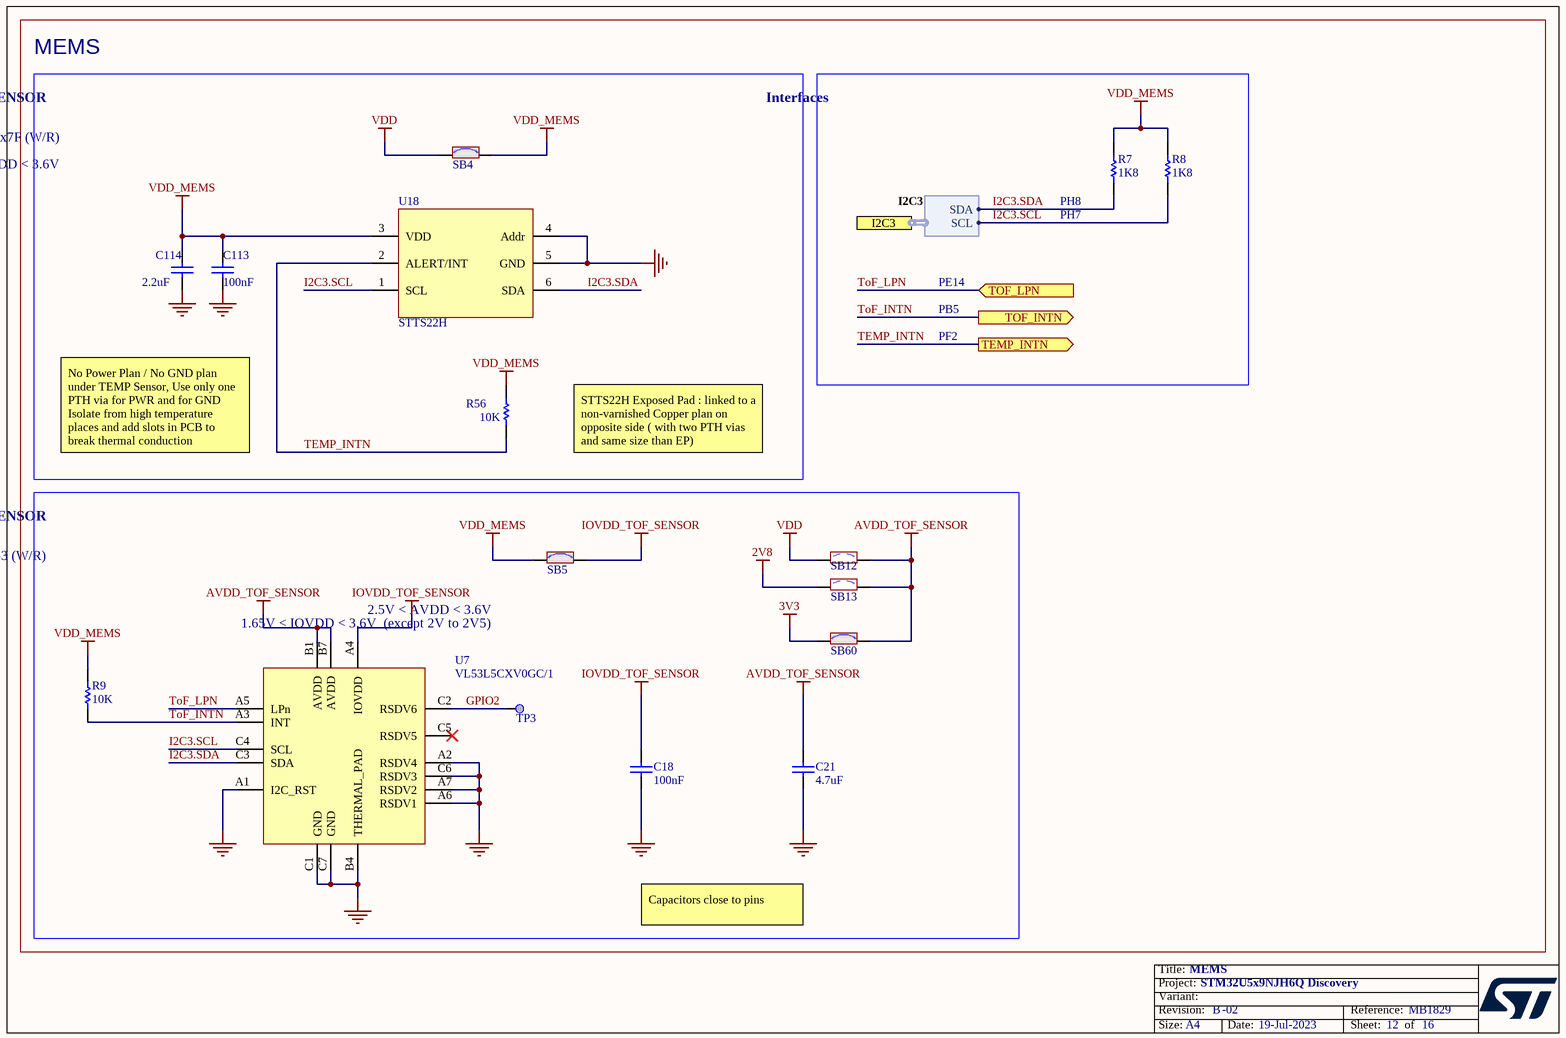
[diagram p15: MEMS.SchDoc]

### Parts
C18  value 100nF  [C0603]  (hidden comment: Capacitor)
C21  value 4.7uF  [C0603_H0P8]  (hidden comment: Capacitor)
C113  value 100nF  [C0603]  (hidden comment: Capacitor)
C114  value 2.2uF  [C0603]  (hidden comment: Capacitor)
R7  value 1K8  [R0402]  (hidden comment: Resistor)
R8  value 1K8  [R0402]  (hidden comment: Resistor)
R9  value 10K  [R0603]  (hidden comment: Resistor)
R56  value 10K  [R0603]  (hidden comment: Resistor)
SB4  SB_ON  [SOLDER-BRIDGE_R0402-0R]  (value not drawn)
SB5  SB_ON  [SOLDER-BRIDGE_R0402-0R]  (value not drawn)
SB12  SB_OFF  [SOLDER-BRIDGE_R0402-0R]  (value not drawn)
SB13  SB_OFF  [SOLDER-BRIDGE_R0402-0R]  (value not drawn)
SB60  SB_ON  [SOLDER-BRIDGE_R0402-0R]  (value not drawn)
TP3  Test Point  [TP_SMD_1MM]  (value not drawn)  (no BOM)
U7  VL53L5CXV0GC/1  [ICC_LGA16_6P4X3_P075_H1P5]
U18  STTS22H  [ICC_UDFN6-EPAD_2X2_P065]

### Blocks framed on the sheet
MEMS: C113 C114 R56 SB4 U18
Interfaces: R7 R8
TIME OF FLIGHT SENSOR: C18 C21 R9 SB5 SB12 SB13 SB60 TP3 U7

### Ports
I2C3 (harness I2C3), TEMP_INTN (out), TOF_INTN (out), TOF_LPN (in)

### Harnesses
I2C3: SDA, SCL

### Nets
2V8: SB13.1
3V3: SB60.1
AVDD_TOF_SENSOR: C21.2 SB12.2 SB13.2 SB60.2 U7.B1(AVDD) U7.B7(AVDD)
GND: C18.2 C21.1 C113.2 C114.1 U7.A1(I2C_RST) U7.A2(RSDV4) U7.A6(RSDV1) U7.A7(RSDV2) U7.B4(THERMAL_PAD) U7.C1(GND) U7.C6(RSDV3) U7.C7(GND) U18.4(Addr) U18.5(GND)
IOVDD_TOF_SENSOR: C18.1 SB5.2 U7.A4(IOVDD)
VDD: SB4.1 SB12.1
VDD_MEMS: C113.1 C114.2 R7.2 R8.2 R9.2 R56.2 SB4.2 SB5.1 U18.3(VDD)
GPIO2: TP3.1 U7.C2(RSDV6)
I2C3.SCL: R8.1 U7.C4(SCL) U18.1(SCL) ; port I2C3.SCL
I2C3.SDA: R7.1 U7.C3(SDA) U18.6(SDA) ; port I2C3.SDA
TEMP_INTN: R56.1 U18.2(ALERT/INT) ; port TEMP_INTN
ToF_INTN: R9.1 U7.A3(INT) ; port TOF_INTN
ToF_LPN: U7.A5(LPn) ; port TOF_LPN

Not connected (* = marked no-connect by the designer): U7 C5(RSDV5)*

### Notes on the sheet
- TEMPERATURE SENSOR
- 1.5V < VDD < 3.6V
- I2C Default address : 0x7E / 0x7F (W/R)
- (near R7) PH7
- (near R7) PH8
- PE14
- PB5
- PF2
- No Power Plan / No GND plan under TEMP Sensor, Use only one PTH via for PWR and for GND
  Isolate from high temperature places and add slots in PCB to break thermal conduction
- STTS22H Exposed Pad : linked to a non-varnished Copper plan on opposite side ( with two PTH vias and same size than EP)
- I2C Default address : 0x52 / 0x53 (W/R)
- 1.65V < IOVDD < 3.6V  (except 2V to 2V5)
- (near SB5) 2.5V < AVDD < 3.6V
- Capacitors close to pins
- Title:
- Project:
- Size:
- Revision:
- Variant:
- A4
- -
- Date:
- Reference:
- Sheet:
- of

### Library data of the parts
C18 C113 = MCD-00211: Capacitor, MLCC, 100nF, 16V, X7R, +/-10%, 0603, T=0.8mm; Manufacturer_Part_Number: CC0603KRX7R7BB104; Manufacturer: YAGEO; Part_Preference: Recommended; Order_Code_RS: 669-8763; Internal_Part_Number: MCD-00211; Status: Released; Part_Type: Capacitor; Package: 0603; ComponentLink1URL: http://tunmcdsvn.tun.st.com/Component_Documentation_Library/Trunk/Capacitor/YAGEO_X7R_Series; Alternate_Manufacturer: N/A; Alternate_Manufacturer_Part_Number: N/A; Order_Code_Digikey: 311-1088-1-ND; Order_Code_Farnell: 432210
C21 = MCD-01721: Capacitor, MLCC, 4.7uF, 10V, X5R, +/-10%, 0603, T=0.8mm; Part_Preference: Recommended; Manufacturer: YAGEO; Manufacturer_Part_Number: CC0603KRX5R6BB475; Internal_Part_Number: MCD-01721; Status: Released; Part_Type: Capacitor; Alternate_Manufacturer: N/A; Alternate_Manufacturer_Part_Number: N/A; Package: 0603; ComponentLink1URL: http://tunmcdsvn.tun.st.com/Component_Documentation_Library/Trunk/Capacitor/YAGEO_X5R_Series; Order_Code_Digikey: 311-1455-1-ND; Order_Code_Farnell: 1458898; Order_Code_RS: N/A
C114 = MCD-00012: Capacitor, MLCC, 2.2uF, 10V, X5R, +/- 10%, 0603, T=0.8mm; BMS_Part_Number: 9142010; Part_Preference: Recommended; Manufacturer: YAGEO; Manufacturer_Part_Number: CC0603KRX5R6BB225; Alternate_Manufacturer: KEMET; Alternate_Manufacturer_Part_Number: C0603C225K8PACTU; Internal_Part_Number: MCD-00012; Status: Released; Part_Type: Capacitor; Package: 0603; ComponentLink1URL: http://tunmcdsvn.tun.st.com/Component_Documentation_Library/Trunk/Capacitor/YAGEO_X5R_Series; Order_Code_Digikey: 311-1451-1-ND; Order_Code_Farnell: 2370679; Order_Code_RS: N/A
R7 R8 = MCD-00409: Resistor, 1K8, 0402, +/-1%, 1/16W; Manufacturer_Part_Number: RC0402FR-071K8L; Manufacturer: YAGEO; Part_Preference: Recommended; Component_Country_Of_Origin: China; Internal_Part_Number: MCD-00409; Status: Released; Part_Type: Resistor; Package: 0402; ComponentLink1URL: http://tunmcdsvn.tun.st.com/Component_Documentation_Library/Trunk/Resistor/YAGEO_RC_L_Series; Order_Code_Digikey: 311-1.80KLRCT-ND; Order_Code_Farnell: 9239260; Order_Code_RS: N/A
R9 R56 = MCD-00220: Resistor, 10K, 0603, +/-1%, 1/10W; Manufacturer_Part_Number: RC0603FR-0710KL; Manufacturer: YAGEO; Part_Preference: Recommended; Internal_Part_Number: MCD-00220; Status: Released; Part_Type: Resistor; Package: 0603; ComponentLink1URL: http://tunmcdsvn.tun.st.com/Component_Documentation_Library/Trunk/Resistor/YAGEO_RC_L_Series; Alternate_Manufacturer: N/A; Alternate_Manufacturer_Part_Number: N/A; Order_Code_Digikey: 311-10.0KHRCT-ND; Order_Code_Farnell: 9238603; Order_Code_RS: N/A
SB4 SB5 SB60 = MCD-01618: as SB41 on sheet eMMC; Internal_Part_Number: MCD-01618; Status: Released; Package: SB0402; ComponentLink1URL: http://tunmcdsvn.tun.st.com/Component_Datasheet_Library/Trunk/Resistors/Yageo_Resistor_RC0402-series; Order_Code_Digikey: 311-0.0JRTR-ND; Order_Code_Farnell: 2363467
SB12 = MCD-02162: as SB39 on sheet eMMC; Internal_Part_Number: MCD-02162; Status: Checked; Package: SB0402; ComponentLink1URL: http://tunmcdsvn.tun.st.com/Component_Datasheet_Library/Trunk/Resistors/Yageo_Resistor_RC0402-series; Order_Code_Digikey: 311-0.0JRTR-ND; Order_Code_Farnell: 2363467
SB13 = MCD-02162: Solder Bridge 0402 OFF; Part_Type: Misc; Manufacturer_Part_Number: RC0402JR-070RL; Manufacturer: YAGEO; Part_Preference: Recommended; Order_Code_RS: 618-5804; Component_Country_Of_Origin: China; ShowFields: YES; ID: 4262; Internal_Part_Number: MCD-02162; Status: Released; Package: SB0402; ComponentLink1URL: http://tunmcdsvn.tun.st.com/Component_Datasheet_Library/Trunk/Resistors/Yageo_Resistor_RC0402-series; Order_Code_Digikey: 311-0.0JRTR-ND; Order_Code_Farnell: 2363467
TP3 = MCD-00074: Test Point 1mm; Part_Type: Misc; Part_Preference: Recommended; Internal_Part_Number: MCD-00074; Status: Released; Manufacturer_Part_Number: n/a; Manufacturer: N/A; ComponentLink1URL: http://na
U7 = MCD-02590: Time-of-Flight 8x8 multizone ranging sensor with wide field of view; Part_Type: IC; Part_Preference: Recommended; Manufacturer: STMICROELECTRONICS; ShowFields: YES; ID: 4696; Internal_Part_Number: MCD-02590; Value: VL53L5CXV0GC/1; Status: New; Manufacturer_Part_Number: VL53L5CXV0GC/1; Package: Optical LGA16; ComponentLink1URL: http://tunmcdsvn.tun.st.com/Component_Documentation_Library/Trunk/IC/STMICROELECTRONICS_VL53L5CX; Order_Code_Digikey: N/A; Order_Code_Farnell: N/A; Order_Code_RS: N/A
U18 = MCD-02159: temperature sensor; Part_Type: IC; Part_Preference: Recommended; Manufacturer: STMICROELECTRONICS; Manufacturer_HQ_COO: EU; Order_code_RS: 194-7646; Component_Country_Of_Origin: Thailand; Value: STTS22H; Order_code_Digikey: 497-STTS22HTR-ND; Order_code_Farnell: 3265386; Status: Checked; ComponentLink1URL: http://tunmcdsvn.tun.st.com/Component_Datasheet_Library/Trunk/IC/STM_MEMS_STTS22H; Internal_Part_Number: MCD-02159; Manufacturer_Part_Number: STTS22H; Alternate_Manufacturer: N/A; Alternate_Manufacturer_Part_Number: N/A; Package: UDFN 6-pins 2x2x0.5mm

## Nets that join several sheets
1V8: EXPANSION_CONNECTORS (CN9.15), AUDIO (SB2.1), BOARD_POWER (C117.2 R59.2 R62.2 TP2.1), DSI_LCD (SB49.1 T1.4)
2V8: BOARD_POWER (C118.2 R66.2 TP1.1), MEMS (SB13.1)
3V3: EXPANSION_CONNECTORS (CN9.7), AUDIO (C1.2 U4.1), BOARD_POWER (JP1.2 R57.1 R77.2), MCU_CLOCK_AND_USER_INTERFACE (R116.2 R125.2), MCU_PWR (SB37.1), USBHS_TYPEC (C71.2 R120.2 U9.1 U11.12), eMMC (SB41.1), DSI_LCD (SB53.1 T3.4), MEMS (SB60.1)
5V: EXPANSION_CONNECTORS (SB54.1), BOARD_POWER (11 pins), ST_LINK_V3E (R54.1), DSI_LCD (R78.2 SB52.1 T4.4)
5V_STLK: BOARD_POWER (JP4.1), ST_LINK_V3E (C141.2 U29.1)
5V_UCPD: BOARD_POWER (JP4.5), ST_LINK_V3E (D1.1), USBHS_TYPEC (7 pins)
5V_USB_CHGR: BOARD_POWER (JP4.7), ST_LINK_V3E (8 pins)
5V_VIN: EXPANSION_CONNECTORS (SB26.1), BOARD_POWER (JP4.3), ST_LINK_V3E (D3.1)
AGND: EXPANSION_CONNECTORS (C25.1 C125.1 CN10.25), MCU_PWR (9 pins)
GND: EXPANSION_CONNECTORS (5 pins), AUDIO (20 pins), BOARD_POWER (36 pins), MCU_CLOCK_AND_USER_INTERFACE (18 pins), MCU_PWR (52 pins), MECHANICAL (5 pins), OCTOSPI_FLASH (9 pins), ST_LINK_V3E (109 pins), USBHS_TYPEC (32 pins), eMMC (32 pins), HEXADECASPI_PSRAM (6 pins), DSI_LCD (20 pins), MEMS (14 pins)
VDD: EXPANSION_CONNECTORS (SB56.1), AUDIO (6 pins), BOARD_POWER (JP2.2 R62.1 R79.1), MCU_CLOCK_AND_USER_INTERFACE (B1.3 B1.4 SW1.2), OCTOSPI_FLASH (SB27.1), ST_LINK_V3E (8 pins), USBHS_TYPEC (C72.1 R36.2 U9.8), eMMC (SB39.1 SB44.1), HEXADECASPI_PSRAM (SB47.1), DSI_LCD (SB51.1 T2.4), MEMS (SB4.1 SB12.1)
VDD_MCU: BOARD_POWER (JP3.2), MCU_PWR (31 pins)
VDDA: EXPANSION_CONNECTORS (C25.2 CN10.23), MCU_PWR (5 pins)
VREFP: EXPANSION_CONNECTORS (C125.2 SB55.2), MCU_PWR (C41.2 C43.2 SB31.1 U25.L5)
AUDIO_MEMs_LED: AUDIO (R1.2 R2.1 U4.7), MCU_IO (U25.M9)
Audio_RSTn: AUDIO (R5.2 U5.25), MCU_IO (U25.D11)
DSI.CK_N: MCU_IO (U25.J1), DSI_LCD (CN2.3)
DSI.CK_P: MCU_IO (U25.H1), DSI_LCD (CN2.5)
DSI.D0_N: MCU_IO (U25.G2), DSI_LCD (CN2.11)
DSI.D0_P: MCU_IO (U25.G1), DSI_LCD (CN2.9)
DSI.D1_N: MCU_IO (U25.K1), DSI_LCD (CN2.17)
DSI.D1_P: MCU_IO (U25.K2), DSI_LCD (CN2.15)
DSI_BL_CTRL: MCU_IO (U25.D5), DSI_LCD (CN2.53)
DSI_PWR_ON: MCU_IO (U25.C4), DSI_LCD (5 pins)
DSI_RESETn: MCU_IO (U25.B8), DSI_LCD (CN2.57 R71.2)
DSI_SPI_CLK: EXPANSION_CONNECTORS (SB23.1), MCU_IO (U25.M12), DSI_LCD (SB17.2)
DSI_SPI_D/CX: EXPANSION_CONNECTORS (SB25.1), MCU_IO (U25.L12), DSI_LCD (SB18.2)
DSI_SPI_MOSI: EXPANSION_CONNECTORS (SB24.1), MCU_IO (U25.A8), DSI_LCD (SB19.2)
DSI_SPI_USART_CS: MCU_IO (U25.N13), DSI_LCD (SB15.2)
DSI_SWIRE: MCU_IO (U25.D4), DSI_LCD (CN2.43)
DSI_TE: MCU_IO (U25.P7), DSI_LCD (CN2.49)
DSI_TOUCH_INT: MCU_IO (U25.M8), DSI_LCD (CN2.4 R72.1)
eMMC_RSTn: MCU_IO (U25.C11), eMMC (R111.1)
HEXASPI1.CLK: MCU_IO (U25.J14), HEXADECASPI_PSRAM (U34.B2)
HEXASPI1.DQS0: MCU_IO (U25.J13), HEXADECASPI_PSRAM (U34.C3)
HEXASPI1.DQS1: MCU_IO (U25.H13), HEXADECASPI_PSRAM (U34.B3)
HEXASPI1.IO0: MCU_IO (U25.L13), HEXADECASPI_PSRAM (U34.D3)
HEXASPI1.IO1: MCU_IO (U25.L14), HEXADECASPI_PSRAM (U34.D2)
HEXASPI1.IO2: MCU_IO (U25.M15), HEXADECASPI_PSRAM (U34.C4)
HEXASPI1.IO3: MCU_IO (U25.L15), HEXADECASPI_PSRAM (U34.D4)
HEXASPI1.IO4: MCU_IO (U25.K13), HEXADECASPI_PSRAM (U34.D5)
HEXASPI1.IO5: MCU_IO (U25.K14), HEXADECASPI_PSRAM (U34.E3)
HEXASPI1.IO6: MCU_IO (U25.K15), HEXADECASPI_PSRAM (U34.E2)
HEXASPI1.IO7: MCU_IO (U25.J12), HEXADECASPI_PSRAM (U34.E1)
HEXASPI1.IO8: MCU_IO (U25.H12), HEXADECASPI_PSRAM (U34.C2)
HEXASPI1.IO9: MCU_IO (U25.G15), HEXADECASPI_PSRAM (U34.B1)
HEXASPI1.IO10: MCU_IO (U25.G14), HEXADECASPI_PSRAM (U34.A2)
HEXASPI1.IO11: MCU_IO (U25.G13), HEXADECASPI_PSRAM (U34.A4)
HEXASPI1.IO12: MCU_IO (U25.F15), HEXADECASPI_PSRAM (U34.A5)
HEXASPI1.IO13: MCU_IO (U25.F14), HEXADECASPI_PSRAM (U34.B4)
HEXASPI1.IO14: MCU_IO (U25.F13), HEXADECASPI_PSRAM (U34.B5)
HEXASPI1.IO15: MCU_IO (U25.E15), HEXADECASPI_PSRAM (U34.C5)
HEXASPI1.NCS: MCU_IO (U25.M14), HEXADECASPI_PSRAM (R52.1 U34.A3)
I2C1.SCL: EXPANSION_CONNECTORS (CN10.2 R29.1 SB7.1), MCU_IO (U25.D7)
I2C1.SDA: EXPANSION_CONNECTORS (CN10.4 R28.1 SB8.1), MCU_IO (U25.B6)
I2C3.SCL: MCU_IO (U25.B11), MEMS (R8.1 U7.C4 U18.1)
I2C3.SDA: MCU_IO (U25.D10), MEMS (R7.1 U7.C3 U18.6)
I2C4.SCL: AUDIO (R14.1 U5.3), MCU_IO (U25.A4)
I2C4.SDA: AUDIO (R13.1 U5.2), MCU_IO (U25.A3)
I2C5.SCL: MCU_IO (U25.B12), DSI_LCD (CN2.44 R70.2)
I2C5.SDA: MCU_IO (U25.C12), DSI_LCD (CN2.40 R69.2)
LED_GREEN: MCU_CLOCK_AND_USER_INTERFACE (R107.1), MCU_IO (U25.A2)
LED_RED: MCU_CLOCK_AND_USER_INTERFACE (R105.1), MCU_IO (U25.B3)
MIC.CCK0: AUDIO (CN1.4 U2.1), MCU_IO (U25.K4)
MIC.SDIN0: AUDIO (CN1.6 U1.1), MCU_IO (U25.K3)
MIC.SDIN4: AUDIO (CN1.5 U3.1), MCU_IO (U25.P10)
NRST: EXPANSION_CONNECTORS (CN9.5), MCU_CLOCK_AND_USER_INTERFACE (B2.1 B2.2 C28.2 U8.1), MCU_IO (U25.R2), OCTOSPI_FLASH (R20.1 R22.1), ST_LINK_V3E (CN3.10 CN11.12 R117.1 U30.5)
OCTOSPIM_P1.CLK: MCU_IO (U25.L1), OCTOSPI_FLASH (U22.B2)
OCTOSPIM_P1.DQS: MCU_IO (U25.P3), OCTOSPI_FLASH (U22.C3)
OCTOSPIM_P1.IO0: MCU_IO (U25.M3), OCTOSPI_FLASH (U22.D3)
OCTOSPIM_P1.IO1: MCU_IO (U25.L4), OCTOSPI_FLASH (U22.D2)
OCTOSPIM_P1.IO2: MCU_IO (U25.L3), OCTOSPI_FLASH (U22.C4)
OCTOSPIM_P1.IO3: MCU_IO (U25.M2), OCTOSPI_FLASH (U22.D4)
OCTOSPIM_P1.IO4: MCU_IO (U25.M1), OCTOSPI_FLASH (U22.D5)
OCTOSPIM_P1.IO5: MCU_IO (U25.P1), OCTOSPI_FLASH (U22.E3)
OCTOSPIM_P1.IO6: MCU_IO (U25.N3), OCTOSPI_FLASH (U22.E2)
OCTOSPIM_P1.IO7: MCU_IO (U25.P2), OCTOSPI_FLASH (U22.E1)
OCTOSPIM_P1.NCS: MCU_IO (U25.M4), OCTOSPI_FLASH (R23.2 R24.1 R25.1)
PA0: EXPANSION_CONNECTORS (CN9.21), MCU_IO (U25.N4)
PA3: EXPANSION_CONNECTORS (CN10.32), MCU_IO (U25.P4)
PA4: EXPANSION_CONNECTORS (CN9.25), MCU_IO (U25.M5)
PA5: EXPANSION_CONNECTORS (SB9.1), MCU_IO (U25.R4)
PA6: EXPANSION_CONNECTORS (CN9.30), MCU_IO (U25.P5)
PA7: EXPANSION_CONNECTORS (CN10.18), MCU_IO (U25.R5)
PB0: EXPANSION_CONNECTORS (CN9.22), MCU_IO (U25.N6)
PB1: EXPANSION_CONNECTORS (CN9.28), MCU_IO (U25.M6)
PB2: EXPANSION_CONNECTORS (CN9.19), MCU_IO (U25.R7)
PB3: EXPANSION_CONNECTORS (SB33.2), MCU_IO (SB34.2 U25.E7)
PB4: EXPANSION_CONNECTORS (CN9.8), MCU_IO (U25.D6)
PB10: EXPANSION_CONNECTORS (SB48.2), MCU_IO (U25.N12), DSI_LCD (SB14.2)
PB11: EXPANSION_CONNECTORS (CN9.24), MCU_IO (U25.M10)
PB12: EXPANSION_CONNECTORS (SB21.1), MCU_IO (U25.M11)
PB14: EXPANSION_CONNECTORS (CN9.2), MCU_IO (U25.P13)
PB15: EXPANSION_CONNECTORS (SB45.2), MCU_IO (SB46.2 U25.R14)
PC4: EXPANSION_CONNECTORS (SB6.1), MCU_IO (U25.R6)
PC5: EXPANSION_CONNECTORS (CN9.23), MCU_IO (U25.P6)
PC14-OSC32_IN: MCU_CLOCK_AND_USER_INTERFACE (C128.1 X3.2), MCU_IO (U25.B1)
PC15-OSC32_OUT: MCU_CLOCK_AND_USER_INTERFACE (C127.1 X3.1), MCU_IO (U25.C1)
PD0: EXPANSION_CONNECTORS (CN10.35), MCU_IO (U25.D9)
PD1: EXPANSION_CONNECTORS (CN10.37), MCU_IO (U25.C9)
PD3: EXPANSION_CONNECTORS (SB20.1), MCU_IO (U25.A9)
PD6: EXPANSION_CONNECTORS (CN9.10), MCU_IO (U25.C8)
PD7: EXPANSION_CONNECTORS (CN9.12), MCU_IO (U25.D8)
PD9: EXPANSION_CONNECTORS (CN10.11), MCU_IO (U25.P15)
PD10: EXPANSION_CONNECTORS (SB22.1), MCU_IO (U25.P14), DSI_LCD (SB16.2)
PD12: EXPANSION_CONNECTORS (CN10.9), MCU_IO (U25.M13)
PD15: EXPANSION_CONNECTORS (CN10.28), MCU_IO (U25.K12)
PE2: EXPANSION_CONNECTORS (CN10.1), AUDIO (U5.30), MCU_IO (U25.E5)
PE4: EXPANSION_CONNECTORS (CN10.7), AUDIO (U5.1), MCU_IO (U25.B2)
PE5: EXPANSION_CONNECTORS (CN10.5), AUDIO (U5.31), MCU_IO (U25.D3)
PE6: EXPANSION_CONNECTORS (CN10.3), AUDIO (U5.32), MCU_IO (U25.E4)
PE7: EXPANSION_CONNECTORS (CN10.30), MCU_IO (U25.N9)
PE11: EXPANSION_CONNECTORS (CN10.26), MCU_IO (U25.P11)
PF0: EXPANSION_CONNECTORS (CN9.14), MCU_IO (U25.H3)
PF1: EXPANSION_CONNECTORS (CN9.16), MCU_IO (U25.J4)
PF5: EXPANSION_CONNECTORS (CN10.34), MCU_IO (U25.L2)
PF12: EXPANSION_CONNECTORS (CN10.24), MCU_IO (U25.N7)
PF13: EXPANSION_CONNECTORS (CN10.20), MCU_IO (U25.M7)
PF14: EXPANSION_CONNECTORS (CN10.29), MCU_IO (U25.R8)
PF15: EXPANSION_CONNECTORS (SB11.1), MCU_IO (SB57.1 U25.P8)
PG0: EXPANSION_CONNECTORS (SB10.1), MCU_IO (SB58.2 U25.R9)
PG7: EXPANSION_CONNECTORS (CN10.36), MCU_IO (U25.D13)
PG8: EXPANSION_CONNECTORS (CN10.38), MCU_IO (U25.E13)
PG9: EXPANSION_CONNECTORS (CN10.10), MCU_IO (U25.A7)
PG10: EXPANSION_CONNECTORS (CN10.12), MCU_IO (U25.B7)
PG11: EXPANSION_CONNECTORS (CN10.14), MCU_IO (U25.C7)
PG15: EXPANSION_CONNECTORS (CN10.16), MCU_IO (U25.A5)
PH0-OSC_IN: MCU_CLOCK_AND_USER_INTERFACE (R26.1), MCU_IO (U25.N1), ST_LINK_V3E (SB28.2)
PH1-OSC_OUT: MCU_CLOCK_AND_USER_INTERFACE (R27.1), MCU_IO (U25.N2)
PH3-BOOT0: MCU_CLOCK_AND_USER_INTERFACE (R55.1), MCU_IO (U25.B4)
SAI1.SD_B: AUDIO (U5.29), MCU_IO (U25.C3)
SDMMC1.CK: MCU_IO (U25.C10), eMMC (R114.1 U26.M6 U27.M6)
SDMMC1.CMD: MCU_IO (U25.B9), eMMC (R113.1 U26.M5 U27.M5)
SDMMC1.D0: MCU_IO (U25.A14), eMMC (R97.1 U26.A3 U27.A3)
SDMMC1.D1: MCU_IO (U25.C14), eMMC (R99.1 U26.A4 U27.A4)
SDMMC1.D2: MCU_IO (U25.A10), eMMC (R100.1 U26.A5 U27.A5)
SDMMC1.D3: MCU_IO (U25.B10), eMMC (R95.1 U26.B2 U27.B2)
SDMMC1.D4: MCU_IO (U25.C6), eMMC (R96.1 U26.B3 U27.B3)
SDMMC1.D5: MCU_IO (U25.C5), eMMC (R98.1 U26.B4 U27.B4)
SDMMC1.D6: MCU_IO (U25.C15), eMMC (R101.1 U26.B5 U27.B5)
SDMMC1.D7: MCU_IO (U25.B15), eMMC (R102.1 U26.B6 U27.B6)
T.JTDI: MCU_IO (SB42.1), ST_LINK_V3E (CN3.8 CN11.10 U33.1)
T.SWCLK: MCU_IO (U25.A12), ST_LINK_V3E (CN3.4 CN11.6 R126.1 U33.4)
T.SWDIO: MCU_IO (U25.C13), ST_LINK_V3E (CN3.2 CN11.4 R124.1 U33.5)
T.SWO: MCU_IO (SB34.1), ST_LINK_V3E (CN3.6 CN11.8 R127.1 U33.3)
T.VCP_RX: MCU_IO (U25.D12), ST_LINK_V3E (CN11.13 R110.2 U30.1)
T.VCP_TX: MCU_IO (U25.E12), ST_LINK_V3E (CN11.14 R118.1 U30.3)
TEMP_INTN: MCU_IO (U25.J3), MEMS (R56.1 U18.2)
ToF_INTN: MCU_IO (U25.B5), MEMS (R9.1 U7.A3)
ToF_LPN: MCU_IO (U25.R10), MEMS (U7.A5)
UCPD.ADC1: MCU_IO (SB38.1 SB58.1), USBHS_TYPEC (R39.2 R43.1)
UCPD.ADC2: MCU_IO (SB40.1 SB57.2), USBHS_TYPEC (R38.2 R40.1)
UCPD.DBn: MCU_IO (U25.P9), USBHS_TYPEC (R37.1 R41.1 U9.7)
UCPD.FLT: MCU_IO (U25.N11), USBHS_TYPEC (R36.1 U11.11)
USBC.HS_N: MCU_IO (U25.B14), USBHS_TYPEC (U35.2)
USBC.HS_P: MCU_IO (U25.B13), USBHS_TYPEC (U35.1)
USER_Button: MCU_CLOCK_AND_USER_INTERFACE (C29.2 R68.1), MCU_IO (U25.F4)
VBUS_SENSE: MCU_IO (U25.N8), USBHS_TYPEC (C59.2 R31.1 R32.2)

## Assembly variants
U5A9NJQ: not fitted C1 C2 C3 C4 C5 C6 C7 C8 C9 C10 C11 C12 C13 C14 C15 C16 C17 C19 C20 C29 C37 C82 C115 C116 C117 C118 C121 C122 C123 C124 C138 CN1 CN3 CN6 CN12 HW2 HW4 L1 LD1 Q2 R1 R2 R3 R4 R5 R6 R10 R11 R12 R13 R14 R15 R20 R23 R28 R29 R41 R57 R58 R59 R60 R61 R63 R64 R65 R66 R67 R73 R74 R75 R76 R77 R78 R79 R80 R85 R114 R121 R122 R123 T1 T2 T3 T4 U1 U2 U3 U4 U5 U6 U19 U20 U27; alternate parts U25 -> MCD-03270
U5G9NJQ: not fitted C3 C4 C5 C6 C7 C8 C9 C10 C11 C12 C13 C14 C15 C16 C17 C19 C20 C29 C37 C82 C115 C116 C117 C118 C121 C122 C123 C124 C138 CN3 CN6 CN12 HW2 HW4 L1 LD1 Q2 R2 R4 R5 R6 R10 R11 R12 R13 R14 R15 R20 R23 R28 R29 R41 R57 R58 R59 R60 R61 R63 R64 R65 R66 R67 R73 R74 R75 R76 R77 R78 R79 R80 R85 R114 R121 R122 R123 T1 T2 T3 T4 U5 U6 U19 U20 U26